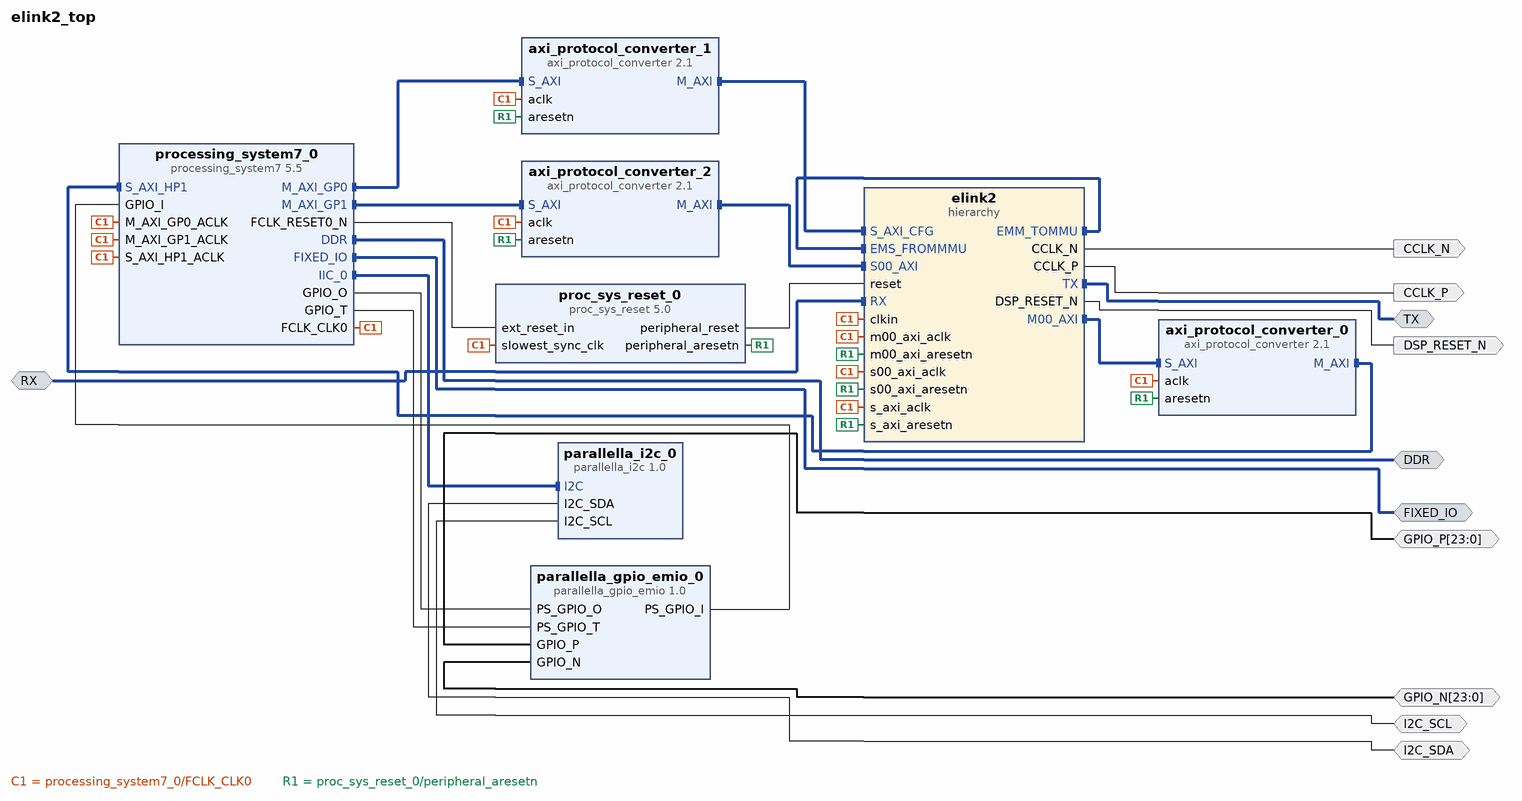
[diagram p0: block diagram of the top level]
# Vivado block design elink2_top, Vivado 2014.3
create_bd_design elink2_top

create_bd_intf_port -mode Master -vlnv xilinx.com:interface:ddrx_rtl:1.0 DDR
create_bd_intf_port -mode Master -vlnv xilinx.com:display_processing_system7:fixedio_rtl:1.0 FIXED_IO
create_bd_intf_port -mode Master -vlnv adapteva.com:interface:eLink_rtl:1.0 TX
create_bd_intf_port -mode Slave -vlnv adapteva.com:interface:eLink_rtl:1.0 RX
create_bd_port -dir O CCLK_P
create_bd_port -dir O CCLK_N
create_bd_port -dir O DSP_RESET_N
create_bd_port -dir IO I2C_SDA
create_bd_port -dir IO I2C_SCL
create_bd_port -dir IO -from 23 -to 0 GPIO_P
create_bd_port -dir IO -from 23 -to 0 GPIO_N

create_bd_cell -type hier elink2
create_bd_cell -type ip -vlnv xilinx.com:ip:axi_protocol_converter:2.1 axi_protocol_converter_0
set_property -dict {CONFIG.TRANSLATION_MODE 0} [get_bd_cells axi_protocol_converter_0]
create_bd_cell -type ip -vlnv xilinx.com:ip:axi_protocol_converter:2.1 axi_protocol_converter_1
set_property -dict {CONFIG.TRANSLATION_MODE 2} [get_bd_cells axi_protocol_converter_1]
create_bd_cell -type ip -vlnv xilinx.com:ip:axi_protocol_converter:2.1 axi_protocol_converter_2
create_bd_cell -type ip -vlnv adapteva.com:Adapteva:parallella_gpio_emio:1.0 parallella_gpio_emio_0
set_property -dict {CONFIG.NUM_GPIO_PAIRS 24} [get_bd_cells parallella_gpio_emio_0]
create_bd_cell -type ip -vlnv adapteva.com:Adapteva:parallella_i2c:1.0 parallella_i2c_0
create_bd_cell -type ip -vlnv xilinx.com:ip:proc_sys_reset:5.0 proc_sys_reset_0
create_bd_cell -type ip -vlnv xilinx.com:ip:processing_system7:5.5 processing_system7_0
set_property -dict [list \
  CONFIG.PCW_UIPARAM_DDR_FREQ_MHZ 400 \
  CONFIG.PCW_SDIO_PERIPHERAL_FREQMHZ 50 \
  CONFIG.PCW_FPGA0_PERIPHERAL_FREQMHZ 100 \
  CONFIG.PCW_FPGA3_PERIPHERAL_FREQMHZ 100 \
  CONFIG.PCW_USE_M_AXI_GP1 1 \
  CONFIG.PCW_USE_S_AXI_HP1 1 \
  CONFIG.PCW_EN_CLK3_PORT 1 \
  CONFIG.PCW_PRESET_BANK1_VOLTAGE {LVCMOS 1.8V} \
  CONFIG.PCW_UIPARAM_DDR_PARTNO Custom \
  CONFIG.PCW_QSPI_PERIPHERAL_ENABLE 1 \
  CONFIG.PCW_ENET0_PERIPHERAL_ENABLE 1 \
  CONFIG.PCW_ENET0_ENET0_IO {MIO 16 .. 27} \
  CONFIG.PCW_ENET0_GRP_MDIO_ENABLE 1 \
  CONFIG.PCW_SD1_PERIPHERAL_ENABLE 1 \
  CONFIG.PCW_SD1_SD1_IO {MIO 10 .. 15} \
  CONFIG.PCW_UART1_PERIPHERAL_ENABLE 1 \
  CONFIG.PCW_UART1_UART1_IO {MIO 8 .. 9} \
  CONFIG.PCW_USB0_PERIPHERAL_ENABLE 1 \
  CONFIG.PCW_USB1_PERIPHERAL_ENABLE 1 \
  CONFIG.PCW_I2C0_PERIPHERAL_ENABLE 1 \
  CONFIG.PCW_GPIO_MIO_GPIO_ENABLE 1 \
  CONFIG.PCW_GPIO_EMIO_GPIO_ENABLE 1 \
] [get_bd_cells processing_system7_0]
# 22 more settings of processing_system7_0 are not shown: defaults, MIO pin electricals, DDR timing, and values the tool derives

# ---- hierarchy /elink2 ----
current_bd_instance /elink2
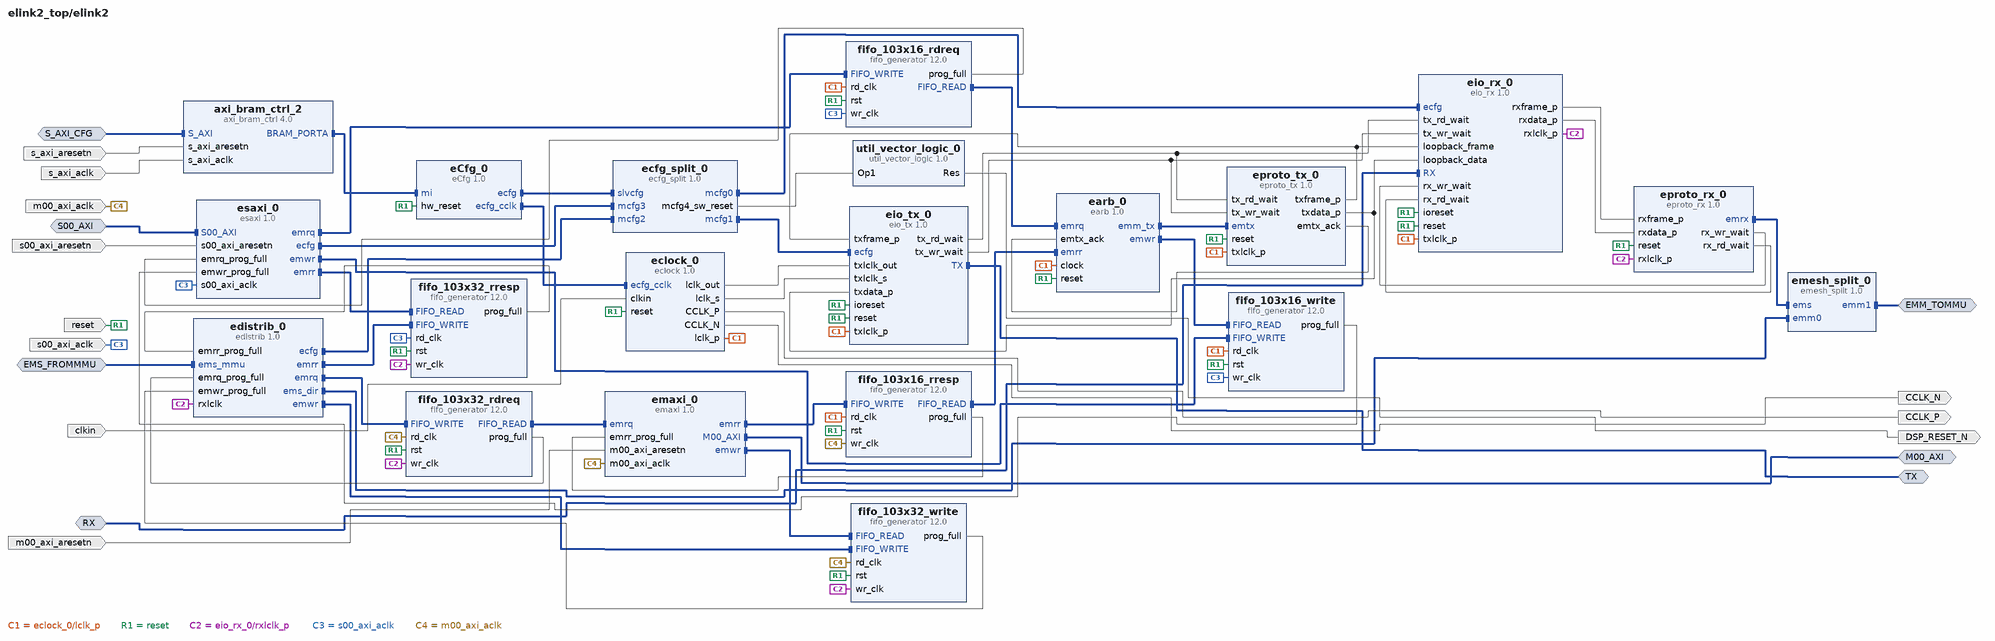
[diagram p1: block diagram inside /elink2]
create_bd_intf_pin -mode Slave -vlnv xilinx.com:interface:aximm_rtl:1.0 S_AXI_CFG
create_bd_intf_pin -mode Slave -vlnv adapteva.com:interface:eLink_rtl:1.0 RX
create_bd_intf_pin -mode Master -vlnv adapteva.com:interface:eLink_rtl:1.0 TX
create_bd_intf_pin -mode Master -vlnv adapteva.com:Adapteva:eMesh_rtl:1.0 EMM_TOMMU
create_bd_intf_pin -mode Slave -vlnv adapteva.com:Adapteva:eMesh_rtl:1.0 EMS_FROMMMU
create_bd_intf_pin -mode Slave -vlnv xilinx.com:interface:aximm_rtl:1.0 S00_AXI
create_bd_intf_pin -mode Master -vlnv xilinx.com:interface:aximm_rtl:1.0 M00_AXI
create_bd_pin -dir I -type clk s_axi_aclk
create_bd_pin -dir I -type rst reset
create_bd_pin -dir I -type rst s_axi_aresetn
create_bd_pin -dir O CCLK_P
create_bd_pin -dir O CCLK_N
create_bd_pin -dir I -type clk s00_axi_aclk
create_bd_pin -dir I -type rst s00_axi_aresetn
create_bd_pin -dir I -type clk m00_axi_aclk
create_bd_pin -dir I -type rst m00_axi_aresetn
create_bd_pin -dir I clkin
create_bd_pin -dir O DSP_RESET_N

create_bd_cell -type ip -vlnv xilinx.com:ip:axi_bram_ctrl:4.0 axi_bram_ctrl_2
set_property -dict {CONFIG.PROTOCOL AXI4LITE CONFIG.SINGLE_PORT_BRAM 1} [get_bd_cells axi_bram_ctrl_2]
create_bd_cell -type ip -vlnv adapteva.com:Adapteva:eCfg:1.0 eCfg_0
set_property -dict {CONFIG.E_VERSION 0x01010303} [get_bd_cells eCfg_0]
create_bd_cell -type ip -vlnv adapteva.com:Adapteva:earb:1.0 earb_0
create_bd_cell -type ip -vlnv adapteva.com:Adapteva:ecfg_split:1.0 ecfg_split_0
create_bd_cell -type ip -vlnv adapteva.com:Adapteva:eclock:1.0 eclock_0
create_bd_cell -type ip -vlnv adapteva.com:Adapteva:edistrib:1.0 edistrib_0
set_property -dict {CONFIG.C_READ_TAG_ADDR 0x810} [get_bd_cells edistrib_0]
create_bd_cell -type ip -vlnv adapteva.com:Adapteva:eio_rx:1.0 eio_rx_0
create_bd_cell -type ip -vlnv adapteva.com:Adapteva:emaxi:1.0 emaxi_0
create_bd_cell -type ip -vlnv adapteva.com:Adapteva:emesh_split:1.0 emesh_split_0
create_bd_cell -type ip -vlnv adapteva.com:Adapteva:eproto_rx:1.0 eproto_rx_0
create_bd_cell -type ip -vlnv adapteva.com:Adatpeva:eproto_tx:1.0 eproto_tx_0
create_bd_cell -type ip -vlnv adapteva.com:Adapteva:esaxi:1.0 esaxi_0
create_bd_cell -type ip -vlnv xilinx.com:ip:fifo_generator:12.0 fifo_103x16_rdreq
set_property -dict [list \
  CONFIG.Fifo_Implementation Independent_Clocks_Distributed_RAM \
  CONFIG.Performance_Options First_Word_Fall_Through \
  CONFIG.Input_Data_Width 103 \
  CONFIG.Input_Depth 16 \
  CONFIG.Use_Dout_Reset true \
  CONFIG.Programmable_Full_Type Single_Programmable_Full_Threshold_Constant \
  CONFIG.Full_Threshold_Assert_Value 12 \
] [get_bd_cells fifo_103x16_rdreq]
create_bd_cell -type ip -vlnv xilinx.com:ip:fifo_generator:12.0 fifo_103x16_rresp
set_property -dict [list \
  CONFIG.Fifo_Implementation Independent_Clocks_Distributed_RAM \
  CONFIG.Performance_Options First_Word_Fall_Through \
  CONFIG.Input_Data_Width 103 \
  CONFIG.Input_Depth 16 \
  CONFIG.Use_Dout_Reset true \
  CONFIG.Programmable_Full_Type Single_Programmable_Full_Threshold_Constant \
  CONFIG.Full_Threshold_Assert_Value 12 \
] [get_bd_cells fifo_103x16_rresp]
create_bd_cell -type ip -vlnv xilinx.com:ip:fifo_generator:12.0 fifo_103x16_write
set_property -dict [list \
  CONFIG.Fifo_Implementation Independent_Clocks_Distributed_RAM \
  CONFIG.Performance_Options First_Word_Fall_Through \
  CONFIG.Input_Data_Width 103 \
  CONFIG.Input_Depth 16 \
  CONFIG.Use_Dout_Reset true \
  CONFIG.Programmable_Full_Type Single_Programmable_Full_Threshold_Constant \
  CONFIG.Full_Threshold_Assert_Value 12 \
] [get_bd_cells fifo_103x16_write]
create_bd_cell -type ip -vlnv xilinx.com:ip:fifo_generator:12.0 fifo_103x32_rdreq
set_property -dict [list \
  CONFIG.Fifo_Implementation Independent_Clocks_Distributed_RAM \
  CONFIG.Performance_Options First_Word_Fall_Through \
  CONFIG.Input_Data_Width 103 \
  CONFIG.Input_Depth 32 \
  CONFIG.Use_Dout_Reset false \
  CONFIG.Programmable_Full_Type Single_Programmable_Full_Threshold_Constant \
  CONFIG.Full_Threshold_Assert_Value 16 \
] [get_bd_cells fifo_103x32_rdreq]
create_bd_cell -type ip -vlnv xilinx.com:ip:fifo_generator:12.0 fifo_103x32_rresp
set_property -dict [list \
  CONFIG.Fifo_Implementation Independent_Clocks_Distributed_RAM \
  CONFIG.Performance_Options First_Word_Fall_Through \
  CONFIG.Input_Data_Width 103 \
  CONFIG.Input_Depth 32 \
  CONFIG.Use_Dout_Reset false \
  CONFIG.Programmable_Full_Type Single_Programmable_Full_Threshold_Constant \
  CONFIG.Full_Threshold_Assert_Value 16 \
] [get_bd_cells fifo_103x32_rresp]
create_bd_cell -type ip -vlnv xilinx.com:ip:fifo_generator:12.0 fifo_103x32_write
set_property -dict [list \
  CONFIG.Fifo_Implementation Independent_Clocks_Distributed_RAM \
  CONFIG.Performance_Options First_Word_Fall_Through \
  CONFIG.Input_Data_Width 103 \
  CONFIG.Input_Depth 32 \
  CONFIG.Use_Dout_Reset false \
  CONFIG.Programmable_Full_Type Single_Programmable_Full_Threshold_Constant \
  CONFIG.Full_Threshold_Assert_Value 16 \
] [get_bd_cells fifo_103x32_write]
create_bd_cell -type ip -vlnv xilinx.com:ip:util_vector_logic:1.0 util_vector_logic_0
set_property -dict {CONFIG.C_SIZE 1 CONFIG.C_OPERATION not} [get_bd_cells util_vector_logic_0]
create_bd_cell -type ip -vlnv adapteva.com:Adapteva:eio_tx:1.0 eio_tx_0

# ---- connections ----

current_bd_instance /elink2
connect_bd_intf_net [get_bd_intf_pins ecfg_split_0/mcfg0] [get_bd_intf_pins eio_rx_0/ecfg]
connect_bd_intf_net [get_bd_intf_pins ecfg_split_0/mcfg1] [get_bd_intf_pins eio_tx_0/ecfg]
connect_bd_intf_net [get_bd_intf_pins axi_bram_ctrl_2/BRAM_PORTA] [get_bd_intf_pins eCfg_0/mi]
connect_bd_intf_net [get_bd_intf_pins eCfg_0/ecfg_cclk] [get_bd_intf_pins eclock_0/ecfg_cclk]
connect_bd_intf_net [get_bd_intf_pins eCfg_0/ecfg] [get_bd_intf_pins ecfg_split_0/slvcfg]
connect_bd_intf_net [get_bd_intf_pins earb_0/emm_tx] [get_bd_intf_pins eproto_tx_0/emtx]
connect_bd_intf_net [get_bd_intf_pins earb_0/emwr] [get_bd_intf_pins fifo_103x16_write/FIFO_READ]
connect_bd_intf_net [get_bd_intf_pins fifo_103x16_rdreq/FIFO_READ] [get_bd_intf_pins earb_0/emrq]
connect_bd_intf_net [get_bd_intf_pins eproto_rx_0/emrx] [get_bd_intf_pins emesh_split_0/ems]
connect_bd_intf_net [get_bd_intf_pins edistrib_0/ecfg] [get_bd_intf_pins ecfg_split_0/mcfg2]
connect_bd_intf_net [get_bd_intf_pins edistrib_0/ems_dir] [get_bd_intf_pins emesh_split_0/emm0]
connect_bd_intf_net [get_bd_intf_pins edistrib_0/emwr] [get_bd_intf_pins fifo_103x32_write/FIFO_WRITE]
connect_bd_intf_net [get_bd_intf_pins edistrib_0/emrr] [get_bd_intf_pins fifo_103x32_rresp/FIFO_WRITE]
connect_bd_intf_net [get_bd_intf_pins edistrib_0/emrq] [get_bd_intf_pins fifo_103x32_rdreq/FIFO_WRITE]
connect_bd_intf_net [get_bd_intf_pins fifo_103x16_rresp/FIFO_READ] [get_bd_intf_pins earb_0/emrr]
connect_bd_intf_net [get_bd_intf_pins esaxi_0/ecfg] [get_bd_intf_pins ecfg_split_0/mcfg3]
connect_bd_intf_net [get_bd_intf_pins esaxi_0/emrq] [get_bd_intf_pins fifo_103x16_rdreq/FIFO_WRITE]
connect_bd_intf_net [get_bd_intf_pins esaxi_0/emwr] [get_bd_intf_pins fifo_103x16_write/FIFO_WRITE]
connect_bd_intf_net [get_bd_intf_pins esaxi_0/emrr] [get_bd_intf_pins fifo_103x32_rresp/FIFO_READ]
connect_bd_intf_net [get_bd_intf_pins fifo_103x32_rdreq/FIFO_READ] [get_bd_intf_pins emaxi_0/emrq]
connect_bd_intf_net [get_bd_intf_pins emaxi_0/emwr] [get_bd_intf_pins fifo_103x32_write/FIFO_READ]
connect_bd_intf_net [get_bd_intf_pins emaxi_0/emrr] [get_bd_intf_pins fifo_103x16_rresp/FIFO_WRITE]
connect_bd_intf_net -intf_net S_AXI_REGS_1 [get_bd_intf_pins S_AXI_CFG] [get_bd_intf_pins axi_bram_ctrl_2/S_AXI]
connect_bd_intf_net [get_bd_intf_pins RX] [get_bd_intf_pins eio_rx_0/RX]
connect_bd_intf_net [get_bd_intf_pins TX] [get_bd_intf_pins eio_tx_0/TX]
connect_bd_intf_net [get_bd_intf_pins EMM_TOMMU] [get_bd_intf_pins emesh_split_0/emm1]
connect_bd_intf_net [get_bd_intf_pins EMS_FROMMMU] [get_bd_intf_pins edistrib_0/ems_mmu]
connect_bd_intf_net [get_bd_intf_pins S00_AXI] [get_bd_intf_pins esaxi_0/S00_AXI]
connect_bd_intf_net [get_bd_intf_pins M00_AXI] [get_bd_intf_pins emaxi_0/M00_AXI]
connect_bd_net [get_bd_pins eclock_0/lclk_p] \
  [get_bd_pins earb_0/clock] [get_bd_pins eio_rx_0/txlclk_p] [get_bd_pins eproto_tx_0/txlclk_p] \
  [get_bd_pins fifo_103x16_rdreq/rd_clk] [get_bd_pins fifo_103x16_rresp/rd_clk] [get_bd_pins fifo_103x16_write/rd_clk] \
  [get_bd_pins eio_tx_0/txlclk_p]
connect_bd_net [get_bd_pins reset] \
  [get_bd_pins eCfg_0/hw_reset] [get_bd_pins earb_0/reset] [get_bd_pins eclock_0/reset] [get_bd_pins eio_rx_0/reset] \
  [get_bd_pins eio_rx_0/ioreset] [get_bd_pins eproto_rx_0/reset] [get_bd_pins eproto_tx_0/reset] \
  [get_bd_pins fifo_103x16_rdreq/rst] [get_bd_pins fifo_103x16_rresp/rst] [get_bd_pins fifo_103x16_write/rst] \
  [get_bd_pins fifo_103x32_rdreq/rst] [get_bd_pins fifo_103x32_rresp/rst] [get_bd_pins fifo_103x32_write/rst] \
  [get_bd_pins eio_tx_0/reset] [get_bd_pins eio_tx_0/ioreset]
connect_bd_net -net aresetn_1 [get_bd_pins s_axi_aresetn] [get_bd_pins axi_bram_ctrl_2/s_axi_aresetn]
connect_bd_net [get_bd_pins eio_tx_0/tx_rd_wait] [get_bd_pins eio_rx_0/tx_rd_wait] [get_bd_pins eproto_tx_0/tx_rd_wait]
connect_bd_net [get_bd_pins eio_tx_0/tx_wr_wait] [get_bd_pins eio_rx_0/tx_wr_wait] [get_bd_pins eproto_tx_0/tx_wr_wait]
connect_bd_net [get_bd_pins eclock_0/lclk_out] [get_bd_pins eio_tx_0/txlclk_out]
connect_bd_net [get_bd_pins eclock_0/lclk_s] [get_bd_pins eio_tx_0/txlclk_s]
connect_bd_net [get_bd_pins eclock_0/CCLK_P] [get_bd_pins CCLK_P]
connect_bd_net [get_bd_pins eclock_0/CCLK_N] [get_bd_pins CCLK_N]
connect_bd_net [get_bd_pins eproto_tx_0/txframe_p] [get_bd_pins eio_rx_0/loopback_frame] [get_bd_pins eio_tx_0/txframe_p]
connect_bd_net [get_bd_pins eproto_tx_0/txdata_p] [get_bd_pins eio_rx_0/loopback_data] [get_bd_pins eio_tx_0/txdata_p]
connect_bd_net [get_bd_pins eio_rx_0/rxlclk_p] \
  [get_bd_pins edistrib_0/rxlclk] [get_bd_pins eproto_rx_0/rxlclk_p] [get_bd_pins fifo_103x32_rdreq/wr_clk] \
  [get_bd_pins fifo_103x32_rresp/wr_clk] [get_bd_pins fifo_103x32_write/wr_clk]
connect_bd_net [get_bd_pins eio_rx_0/rxframe_p] [get_bd_pins eproto_rx_0/rxframe_p]
connect_bd_net [get_bd_pins eio_rx_0/rxdata_p] [get_bd_pins eproto_rx_0/rxdata_p]
connect_bd_net -net fifo_103x32_0_prog_full [get_bd_pins fifo_103x32_write/prog_full] [get_bd_pins edistrib_0/emwr_prog_full]
connect_bd_net -net fifo_103x32_2_prog_full [get_bd_pins fifo_103x32_rdreq/prog_full] [get_bd_pins edistrib_0/emrq_prog_full]
connect_bd_net -net fifo_103x32_1_prog_full [get_bd_pins fifo_103x32_rresp/prog_full] [get_bd_pins edistrib_0/emrr_prog_full]
connect_bd_net [get_bd_pins s00_axi_aclk] \
  [get_bd_pins esaxi_0/s00_axi_aclk] [get_bd_pins fifo_103x16_rdreq/wr_clk] [get_bd_pins fifo_103x16_write/wr_clk] \
  [get_bd_pins fifo_103x32_rresp/rd_clk]
connect_bd_net [get_bd_pins m00_axi_aclk] \
  [get_bd_pins emaxi_0/m00_axi_aclk] [get_bd_pins fifo_103x16_rresp/wr_clk] [get_bd_pins fifo_103x32_rdreq/rd_clk] \
  [get_bd_pins fifo_103x32_write/rd_clk]
connect_bd_net [get_bd_pins eproto_rx_0/rx_wr_wait] [get_bd_pins eio_rx_0/rx_wr_wait]
connect_bd_net [get_bd_pins eproto_rx_0/rx_rd_wait] [get_bd_pins eio_rx_0/rx_rd_wait]
connect_bd_net [get_bd_pins s00_axi_aresetn] [get_bd_pins esaxi_0/s00_axi_aresetn]
connect_bd_net [get_bd_pins fifo_103x16_rdreq/prog_full] [get_bd_pins esaxi_0/emrq_prog_full]
connect_bd_net [get_bd_pins fifo_103x16_write/prog_full] [get_bd_pins esaxi_0/emwr_prog_full]
connect_bd_net [get_bd_pins eproto_tx_0/emtx_ack] [get_bd_pins earb_0/emtx_ack]
connect_bd_net [get_bd_pins fifo_103x16_rresp/prog_full] [get_bd_pins emaxi_0/emrr_prog_full]
connect_bd_net [get_bd_pins m00_axi_aresetn] [get_bd_pins emaxi_0/m00_axi_aresetn]
connect_bd_net [get_bd_pins s_axi_aclk] [get_bd_pins axi_bram_ctrl_2/s_axi_aclk]
connect_bd_net [get_bd_pins clkin] [get_bd_pins eclock_0/clkin]
connect_bd_net [get_bd_pins ecfg_split_0/mcfg4_sw_reset] [get_bd_pins util_vector_logic_0/Op1]
connect_bd_net [get_bd_pins util_vector_logic_0/Res] [get_bd_pins DSP_RESET_N]

current_bd_instance /
connect_bd_intf_net [get_bd_intf_pins elink2/EMS_FROMMMU] [get_bd_intf_pins elink2/EMM_TOMMU]
connect_bd_intf_net [get_bd_intf_pins axi_protocol_converter_0/M_AXI] [get_bd_intf_pins processing_system7_0/S_AXI_HP1]
connect_bd_intf_net [get_bd_intf_pins axi_protocol_converter_0/S_AXI] [get_bd_intf_pins elink2/M00_AXI]
connect_bd_intf_net [get_bd_intf_pins axi_protocol_converter_1/M_AXI] [get_bd_intf_pins elink2/S_AXI_CFG]
connect_bd_intf_net [get_bd_intf_pins axi_protocol_converter_2/M_AXI] [get_bd_intf_pins elink2/S00_AXI]
connect_bd_intf_net [get_bd_intf_pins processing_system7_0/M_AXI_GP0] [get_bd_intf_pins axi_protocol_converter_1/S_AXI]
connect_bd_intf_net [get_bd_intf_pins processing_system7_0/M_AXI_GP1] [get_bd_intf_pins axi_protocol_converter_2/S_AXI]
connect_bd_intf_net [get_bd_intf_pins processing_system7_0/IIC_0] [get_bd_intf_pins parallella_i2c_0/I2C]
connect_bd_intf_net [get_bd_intf_ports DDR] [get_bd_intf_pins processing_system7_0/DDR]
connect_bd_intf_net [get_bd_intf_ports FIXED_IO] [get_bd_intf_pins processing_system7_0/FIXED_IO]
connect_bd_intf_net [get_bd_intf_ports TX] [get_bd_intf_pins elink2/TX]
connect_bd_intf_net [get_bd_intf_ports RX] [get_bd_intf_pins elink2/RX]
connect_bd_net [get_bd_pins processing_system7_0/FCLK_CLK0] \
  [get_bd_pins elink2/s_axi_aclk] [get_bd_pins elink2/s00_axi_aclk] [get_bd_pins elink2/m00_axi_aclk] \
  [get_bd_pins axi_protocol_converter_0/aclk] [get_bd_pins axi_protocol_converter_1/aclk] \
  [get_bd_pins axi_protocol_converter_2/aclk] [get_bd_pins proc_sys_reset_0/slowest_sync_clk] \
  [get_bd_pins processing_system7_0/M_AXI_GP0_ACLK] [get_bd_pins processing_system7_0/M_AXI_GP1_ACLK] \
  [get_bd_pins processing_system7_0/S_AXI_HP1_ACLK] [get_bd_pins elink2/clkin]
connect_bd_net [get_bd_pins elink2/CCLK_P] [get_bd_ports CCLK_P]
connect_bd_net [get_bd_pins elink2/CCLK_N] [get_bd_ports CCLK_N]
connect_bd_net [get_bd_pins processing_system7_0/FCLK_RESET0_N] [get_bd_pins proc_sys_reset_0/ext_reset_in]
connect_bd_net [get_bd_pins proc_sys_reset_0/peripheral_aresetn] \
  [get_bd_pins elink2/s_axi_aresetn] [get_bd_pins elink2/s00_axi_aresetn] [get_bd_pins elink2/m00_axi_aresetn] \
  [get_bd_pins axi_protocol_converter_0/aresetn] [get_bd_pins axi_protocol_converter_1/aresetn] \
  [get_bd_pins axi_protocol_converter_2/aresetn]
connect_bd_net [get_bd_pins proc_sys_reset_0/peripheral_reset] [get_bd_pins elink2/reset]
connect_bd_net -net elink2_mcfg4_sw_reset [get_bd_pins elink2/DSP_RESET_N] [get_bd_ports DSP_RESET_N]
connect_bd_net [get_bd_pins parallella_gpio_emio_0/PS_GPIO_I] [get_bd_pins processing_system7_0/GPIO_I]
connect_bd_net [get_bd_pins processing_system7_0/GPIO_O] [get_bd_pins parallella_gpio_emio_0/PS_GPIO_O]
connect_bd_net [get_bd_pins processing_system7_0/GPIO_T] [get_bd_pins parallella_gpio_emio_0/PS_GPIO_T]
connect_bd_net [get_bd_ports I2C_SDA] [get_bd_pins parallella_i2c_0/I2C_SDA]
connect_bd_net [get_bd_ports I2C_SCL] [get_bd_pins parallella_i2c_0/I2C_SCL]
connect_bd_net [get_bd_ports GPIO_P] [get_bd_pins parallella_gpio_emio_0/GPIO_P]
connect_bd_net [get_bd_ports GPIO_N] [get_bd_pins parallella_gpio_emio_0/GPIO_N]

# ---- address map ----
assign_bd_address -offset 0x0 -range 1G -target_address_space [get_bd_addr_spaces elink2/emaxi_0/M00_AXI] [get_bd_addr_segs processing_system7_0/S_AXI_HP1/HP1_DDR_LOWOCM]
assign_bd_address -offset 0x70000000 -range 8K -target_address_space [get_bd_addr_spaces processing_system7_0/Data] [get_bd_addr_segs elink2/axi_bram_ctrl_2/S_AXI/Mem0]
assign_bd_address -offset 0x80000000 -range 1G -target_address_space [get_bd_addr_spaces processing_system7_0/Data] [get_bd_addr_segs elink2/esaxi_0/S00_AXI/S00_AXI_mem]

validate_bd_design
save_bd_design
